# Altium schematic sheet pca10156_sheet5_misc.SchDoc: =BoardTitle+' - Misc'
size A3; Organization: Nordic Semiconductor; DocumentNumber: 5; SheetNumber: 5; SheetTotal: 8; CompanyName: Nordic Semiconductor; DocumentSize: A4
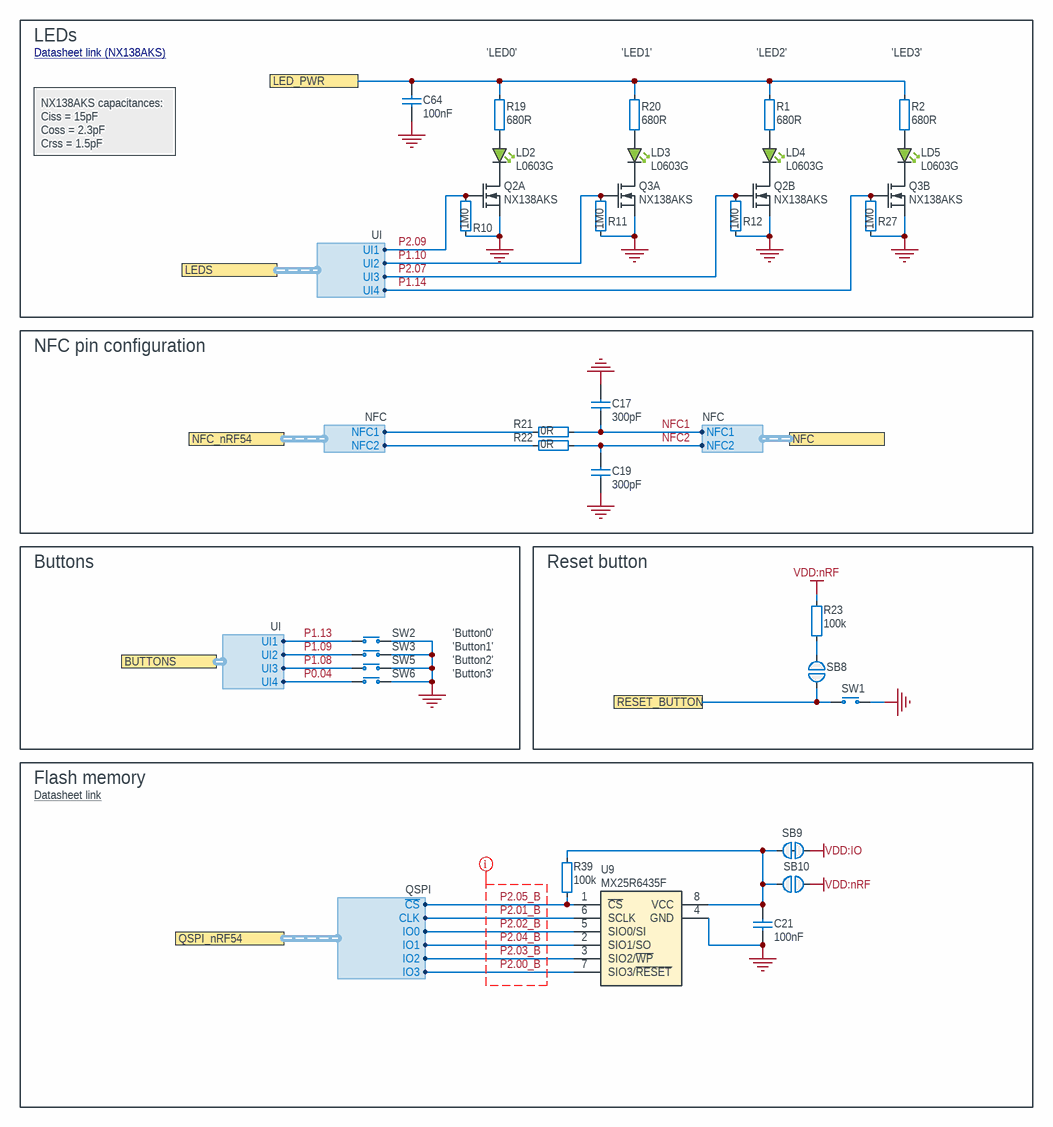
[diagram p0: pca10156_sheet5_misc.SchDoc]

## Parts
C17  300pF  [CAPC1005X04L]
C19  300pF  [CAPC1005X04L]
C21  100nF  [CAPC0603X03L_C]
C64  100nF  [CAPC0603X03L_C]
LD2  L0603G  [LED_0603_G]
LD3  L0603G  [LED_0603_G]
LD4  L0603G  [LED_0603_G]
LD5  L0603G  [LED_0603_G]
Q2  NX138AKS  [TSSOP6]  (parts A,B of 2)
Q3  NX138AKS  [TSSOP6]  (parts A,B of 2)
R1  680R  [RESC0603X03L_C]
R2  680R  [RESC0603X03L_C]
R10  1M0  [RESC0603X03L_C]
R11  1M0  [RESC0603X03L_C]
R12  1M0  [RESC0603X03L_C]
R19  680R  [RESC0603X03L_C]
R20  680R  [RESC0603X03L_C]
R21  0R  [RESC1005X04L]
R22  0R  [RESC1005X04L]
R23  100k  [RESC0603X03L_C]
R27  1M0  [RESC0603X03L_C]
R39  100k  [RESC0603X03L_C]
SB8  Solderbridge  [Solderbridge]  (value not drawn)  (no BOM)
SB9  Solderbridge  [Solderbridge_Shorted]  (value not drawn)  (net tie, no BOM)
SB10  Solderbridge  [Solderbridge]  (value not drawn)  (no BOM)
SW1  PB SW  [Switch-PB-6.2x6.3mm-SMD]  (value not drawn)
SW2  PB SW  [Switch-PB-6.2x6.3mm-SMD]  (value not drawn)
SW3  PB SW  [Switch-PB-6.2x6.3mm-SMD]  (value not drawn)
SW5  PB SW  [Switch-PB-6.2x6.3mm-SMD]  (value not drawn)
SW6  PB SW  [Switch-PB-6.2x6.3mm-SMD]  (value not drawn)
U9  MX25R6435F  [SON127P600X80_HS-9N]

## Blocks framed on the sheet
LEDs: C64 LD2-LD5 Q2 Q3 R1 R2 R10-R12 R19 R20 R27
NFC pin configuration: C17 C19 R21 R22
Buttons: SW2 SW3 SW5 SW6
Reset button: R23 SB8 SW1
Flash memory: C21 R39 SB9 SB10 U9

## Ports
BUTTONS (harness UI), LED_PWR, LEDS (harness UI), NFC (harness NFC), NFC_nRF54 (harness NFC), QSPI_nRF54 (harness QSPI), RESET_BUTTON

## Harnesses
NFC: NFC2, NFC1
UI: UI2, UI1, UI3, UI4
UI: UI2, UI3, UI4, UI1
QSPI: ~{CS}, IO0, CLK, IO1, IO2, IO3

## Nets
GND: C17.2 C19.1 C21.2 C64.1 Q2.1(S1) Q2.4(S2) Q3.1(S1) Q3.4(S2) R10.2 R11.2 R12.2 R27.2 SW1.1(N.O) SW2.1(N.O) SW3.1(N.O) SW5.1(N.O) SW6.1(N.O) U9.4(GND) U9.9(GND)
VDD:IO: SB9.1
VDD:nRF: R23.2 SB10.1
LED_PWR: C64.2 R1.2 R2.2 R19.2 R20.2 ; port LED_PWR
NFC1: C17.1 R21.2 ; port NFC.NFC1
NFC2: C19.2 R22.2 ; port NFC.NFC2
P0.04: SW6.2(COM) ; port BUTTONS.UI4
P1.08: SW5.2(COM) ; port BUTTONS.UI3
P1.09: SW3.2(COM) ; port BUTTONS.UI2
P1.10: Q3.2(G1) R11.1 ; port LEDS.UI2
P1.13: SW2.2(COM) ; port BUTTONS.UI1
P1.14: Q3.5(G2) R27.1 ; port LEDS.UI4
P2.00_B: U9.7(SIO3/~{RESET}) ; port QSPI_nRF54.IO3
P2.01_B: U9.6(SCLK) ; port QSPI_nRF54.CLK
P2.02_B: U9.5(SIO0/SI) ; port QSPI_nRF54.IO0
P2.03_B: U9.3(SIO2/~{WP}) ; port QSPI_nRF54.IO2
P2.04_B: U9.2(SIO1/SO) ; port QSPI_nRF54.IO1
P2.05_B: R39.1 U9.1(~{CS}) ; port QSPI_nRF54.~{CS}
P2.07: Q2.5(G2) R12.1 ; port LEDS.UI3
P2.09: Q2.2(G1) R10.1 ; port LEDS.UI1
RESET_BUTTON: SB8.1 SW1.2(COM) ; port RESET_BUTTON
NetC21_1: C21.1 R39.2 SB9.2 SB10.2 U9.8(VCC)
NetLD2_1: LD2.1(C) Q2.6(D1)
NetLD2_2: LD2.2(A) R19.1
NetLD3_1: LD3.1(C) Q3.6(D1)
NetLD3_2: LD3.2(A) R20.1
NetLD4_1: LD4.1(C) Q2.3(D2)
NetLD4_2: LD4.2(A) R1.1
NetLD5_1: LD5.1(C) Q3.3(D2)
NetLD5_2: LD5.2(A) R2.1
NetR21_1: R21.1 ; port NFC_nRF54.NFC1
NetR22_1: R22.1 ; port NFC_nRF54.NFC2
NetR23_1: R23.1 SB8.2

## Layout directives
net class QSPI: P2.00_B, P2.01_B, P2.02_B, P2.03_B, P2.04_B, P2.05_B

## Notes on the sheet
- Datasheet link (NX138AKS) <https://assets.nexperia.com/documents/data-sheet/NX138AKS.pdf>
- (near R19) 'LED0'
- (near R20) 'LED1'
- (near R1) 'LED2'
- (near R2) 'LED3'
- NX138AKS capacitances:
  Ciss = 15pF
  Coss = 2.3pF
  Crss = 1.5pF
- 'Button0'
- 'Button1'
- 'Button2'
- 'Button3'
- Datasheet link <https://www.mxic.com.tw/Lists/Datasheet/Attachments/8868/MX25R6435F,%20Wide%20Range,%2064Mb,%20v1.6.pdf>
- Title
- Size
- Date:
- File:
- A3
- PCB Assembly Number
- Sheet
- Drawn By:
- Revision
- of
- Classification:

## Library data of the parts
C17 C19 = C0402-300p: Capacitor, C0G, ±5%, 50V; Manufacturer: N.A.; Part number IPS: 00000007788; Part number NEMS: 100200155; Artikkelnr Noca: 20020004; Pad Count: 2; Component Status: Active; Part Number: C0402-300p; Manufacturer Part Number: N.A.; Footprint Doc: 0402; LatestRevisionDate: 2020-10-13; Published: 2015-05-29; Value: 300pF; Note: 50V; ComponentLink1URL: N.A.; ComponentLink1Description: Datasheet; ComponentLink2URL: N.A.; ComponentLink2Description: Supplier link; HelpURL: N.A.; Supplier 1: Digi-Key; Supplier Part Number 1: 490-3234-1-ND; Supplier 2: N.A.; Supplier Part Number 2: N.A.; Component Class: Capacitors; PartId: 100200155; Author: rsk; Part number Norautron: N.A.
C21 = C0201-100n: Capacitor, X5R, ±10%; Manufacturer: N.A.; Part number IPS: 00000001248, 00000002505; Part number Norautron: 262071862; Part number NEMS: 100200078; Pad Count: 2; Note: 16V; Component Status: Active; Part Number: C0201-100n; Value: 100nF; Footprint Doc: 0201; Component Class: Capacitors; Author: rsk; PartId: 100200078; Manufacturer Part Number: N.A.; ComponentLink1URL: N.A.; ComponentLink1Description: Datasheet; ComponentLink2URL: N.A.; ComponentLink2Description: Supplier link; HelpURL: N.A.; LatestRevisionDate: 2017-11-09; Published: 2014-11-13; Supplier 1: N.A.; Supplier Part Number 1: N.A.; Supplier 2: N.A.; Supplier Part Number 2: N.A.; Artikkelnr Noca: N.A.
C64 = C0201-100n: Capacitor, X5R, ±10%; Manufacturer: N.A.; Part number IPS: 00000001248, 00000002505; Part number Norautron: 262071862; Part number NEMS: 100200078; Note: 16V; Pad Count: 2; Component Status: Active; Part Number: C0201-100n; Manufacturer Part Number: N.A.; LatestRevisionDate: 2017-11-09; Published: 2014-11-13; Value: 100nF; Artikkelnr Noca: N.A.; Footprint Doc: 0201; ComponentLink1URL: N.A.; ComponentLink1Description: Datasheet; ComponentLink2URL: N.A.; ComponentLink2Description: Supplier link; HelpURL: N.A.; Supplier 1: N.A.; Supplier Part Number 1: N.A.; Supplier 2: N.A.; Supplier Part Number 2: N.A.; Component Class: Capacitors; PartId: 100200078; Author: rsk
LD2-LD5 = VS 25C7M5: LED, Green, 0603, 573nm, Vf=2.0V, 24mcd, - 40 to +85°C; Manufacturer: Victory Electronics; Part number IPS: 00000001274, 00000009961; Part number Norautron: 26313411; Part number NEMS: 101400097; Pad Count: 2; Note: N.A.; Artikkelnr Noca: 13019193; Component Status: Active; Part Number: VS 25C7M5; PartId: 101400097; Component Class: Optoelectronics; Author: rsk; Manufacturer Part Number: VS 25C7M5; ComponentLink1URL: N.A.; ComponentLink1Description: Datasheet; ComponentLink2URL: N.A.; ComponentLink2Description: Supplier link; HelpURL: \\hizz\pro\app9717\Datasheet\optoelectronics\Victory Electronics\VS 25C7M5.pdf; Footprint Doc: 0603; LatestRevisionDate: 2020-10-23; Published: 2017-08-21; Value: L0603G; Supplier 1: EC Partner; Supplier Part Number 1: N.A.; Supplier 2: N.A.; Supplier Part Number 2: N.A.
Q2 Q3 = NX138AKS: MOSFET 2N-CH 60V 0.17A TSSOP6 (SOT363); Manufacturer: Nexperia; Manufacturer Part Number: NX138AKSX; Part number NEMS: 101300207; Component Status: Active; Pad Count: 6; Note: N.A.; Part Number: NX138AKS; Component Class: Semiconductors; Author: stl1; ComponentLink1URL: https://assets.nexperia.com/documents/data-sheet/NX138AKS.pdf; ComponentLink1Description: Datasheet; ComponentLink2URL: N.A.; ComponentLink2Description: Supplier link; HelpURL: N.A.; LatestRevisionDate: 2023-11-20; Published: 2023-11-20; Footprint Doc: TSSOP6; Value: NX138AKS; Supplier 1: Digi-Key; Supplier Part Number 1: 1727-2732-2-ND; Supplier 2: Mouser; Supplier Part Number 2: 771-NX138AKSX; Artikkelnr Noca: N.A.; Part number IPS: N.A.; Part number Norautron: N.A.; PartId: 101300207
R1 R2 R19 R20 = R0201-680: Resistor, ±1%, 0.05W; Manufacturer: N.A.; Part number NEMS: 100100040; Component Status: Active; Pad Count: 2; Note: Chip Res 1%; Part Number: R0201-680; PartId: 100100040; Component Class: Resistors; Author: rsk; Manufacturer Part Number: N.A.; ComponentLink1URL: N.A.; ComponentLink1Description: Datasheet; ComponentLink2URL: N.A.; ComponentLink2Description: Supplier link; HelpURL: N.A.; LatestRevisionDate: 2014-11-13; Published: 2014-11-13; Footprint Doc: 0201; Value: 680R; Supplier 1: N.A.; Supplier Part Number 1: N.A.; Supplier 2: N.A.; Supplier Part Number 2: N.A.; Artikkelnr Noca: N.A.; Part number IPS: N.A.; Part number Norautron: N.A.
R10-R12 R27 = R0201-1M0: Resistor, ±1%, 0.05W; Manufacturer: N.A.; Part number IPS: 00000001418; Part number Norautron: 26107108; Part number NEMS: 100100093; Component Status: Active; Pad Count: 2; Note: Chip Res 1%; Part Number: R0201-1M0; PartId: 100100093; Component Class: Resistors; Author: rsk; Manufacturer Part Number: N.A.; ComponentLink1URL: N.A.; ComponentLink1Description: Datasheet; ComponentLink2URL: N.A.; ComponentLink2Description: Supplier link; HelpURL: N.A.; LatestRevisionDate: 2014-11-13; Published: 2014-11-13; Footprint Doc: 0201; Value: 1M0; Supplier 1: N.A.; Supplier Part Number 1: N.A.; Supplier 2: N.A.; Supplier Part Number 2: N.A.; Artikkelnr Noca: N.A.
R21 R22 = R0402-0R: Resistor, ±5%, 0.063W; Manufacturer: N.A.; Part number IPS: 00000007128; Part number NEMS: 100100109; Component Status: Active; Pad Count: 2; Note: Chip Res 5%; Artikkelnr Noca: 27049000; Part Number: R0402-0R; PartId: 100100109; Component Class: Resistors; Author: rsk; Manufacturer Part Number: N.A.; ComponentLink1URL: N.A.; ComponentLink1Description: Datasheet; ComponentLink2URL: N.A.; ComponentLink2Description: Supplier link; HelpURL: N.A.; LatestRevisionDate: 2009-11-23; Published: 2009-05-08; Footprint Doc: 0402; Value: 0R; Supplier 1: Farnell; Supplier Part Number 1: 146-9661; Supplier 2: N.A.; Supplier Part Number 2: N.A.; Part number Norautron: N.A.
R23 R39 = R0201-100k: Resistor, ±1%, 0.05W; Manufacturer: N.A.; Part number IPS: 00000001419; Part number Norautron: 26108487; Part number NEMS: 100100080; Note: Chip Res 1%; Pad Count: 2; Component Status: Active; Part Number: R0201-100k; Manufacturer Part Number: N.A.; Footprint Doc: 0201; LatestRevisionDate: 2014-11-13; Published: 2014-11-13; Value: 100k; Artikkelnr Noca: N.A.; ComponentLink1URL: N.A.; ComponentLink1Description: Datasheet; ComponentLink2URL: N.A.; ComponentLink2Description: Supplier link; HelpURL: N.A.; Supplier 1: N.A.; Supplier Part Number 1: N.A.; Supplier 2: N.A.; Supplier Part Number 2: N.A.; Component Class: Resistors; PartId: 100100080; Author: rsk
SB8 SB10 = Solderbridge: Manufacturer: N.A.; Part number NEMS: 100500458; Pad Count: 2; Component Status: Active; System: Connector; Part Number: Solderbridge; Manufacturer Part Number: N.A.; LatestRevisionDate: 2009-12-14; Published: 2009-12-14; Value: Solderbridge; Note: N.A.; Artikkelnr Noca: N.A.; Footprint Doc: Solderbridge; Part number IPS: N.A.; ComponentLink1URL: N.A.; ComponentLink1Description: Datasheet; ComponentLink2URL: N.A.; ComponentLink2Description: Supplier link; HelpURL: N.A.; Supplier 1: N.A.; Supplier Part Number 1: N.A.; Supplier 2: N.A.; Supplier Part Number 2: N.A.; Component Class: Connectors; PartId: 100500458; Author: rsk; Part number Norautron: N.A.
SB9 = Solderbridge Shorted: Shorted Solderbridge; Manufacturer: N.A.; Part number NEMS: 100500459; Pad Count: 2; Component Status: Active; System: Connector; Part Number: Solderbridge Shorted; Manufacturer Part Number: N.A.; LatestRevisionDate: 2012-08-07; Published: 2012-08-07; Value: Solderbridge; Note: N.A.; Artikkelnr Noca: N.A.; Footprint Doc: Solderbridge_Shorted; Part number IPS: N.A.; ComponentLink1URL: N.A.; ComponentLink1Description: Datasheet; ComponentLink2URL: N.A.; ComponentLink2Description: Supplier link; HelpURL: N.A.; Supplier 1: N.A.; Supplier Part Number 1: N.A.; Supplier 2: N.A.; Supplier Part Number 2: N.A.; Component Class: Connectors; PartId: 100500459; Author: rsk; Part number Norautron: N.A.
SW1-SW3 SW5 SW6 = Switch-PB-6.2x6.3mm-SMD: Tactile Switch, SPNO, SMD, 160gf, 6.2x6.3x2.5mm; Manufacturer: Dailywell; Manufacturer Part Number: TS604VM1-025BR-R; Part number IPS: 00000007812; Part number NEMS: 101500001, 101500133; Note: N.A.; Artikkelnr Noca: 50019106; Pad Count: 4; Component Status: Active; Part Number: Switch-PB-6.2x6.3mm-SMD; Footprint Doc: Switch-PB-6.2x6.3mm-SMD; LatestRevisionDate: 2016-04-21; Published: 2010-02-01; Value: PB SW; ComponentLink1URL: N.A.; ComponentLink1Description: Datasheet; ComponentLink2URL: N.A.; ComponentLink2Description: Supplier link; HelpURL: \\hizz\pro\app9717\Datasheet\switches\Dailywell\TS604VM1-025BR-R.pdf; Supplier 1: Cabcon; Supplier Part Number 1: TS604VM1-025BR-R; Supplier 2: Mouser; Supplier Part Number 2: 688-SKHUALE010; Component Class: Switches; PartId: 101500001; Author: rsk; Part number Norautron: N.A.
U9 = MX25R6435FZNIL0: Ultra low power, 64M-bit, serial multi I/O flash memory; Manufacturer: Macronix; Part number IPS: 00000004370; Part number NEMS: 101900438; Note: N.A.; Artikkelnr Noca: 15020015; Pad Count: 8; Component Status: Active; Part Number: MX25R6435FZNIL0; Manufacturer Part Number: MX25R6435FZNIL0; Footprint Doc: WSON-8; LatestRevisionDate: 2021-02-26; Published: 2016-06-29; Value: MX25R6435F; ComponentLink1URL: N.A.; ComponentLink1Description: Datasheet; ComponentLink2URL: N.A.; ComponentLink2Description: Supplier link; HelpURL: https://www.macronix.com/Lists/Datasheet/Attachments/7913/MX25R6435F,%20Wide%20Range,%2064Mb,%20v1.5.pdf; Supplier 1: Future; Supplier Part Number 1: MX25R6435FZNIL0; Supplier 2: Arrow; Supplier Part Number 2: MX25R6435FZNIL0; Component Class: Misc_ICs; PartId: 101900438; Author: rsk; Part number Norautron: N.A.